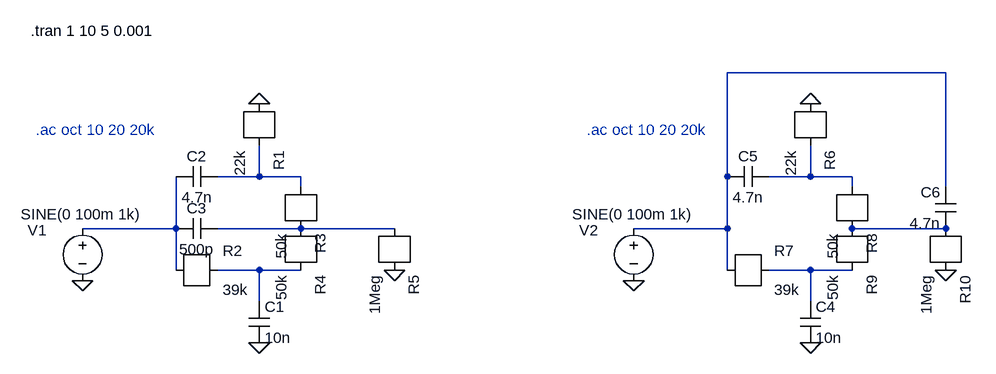
[diagram p0: schematic bigmuff_tone.asc]
bigmuff_tone.asc, the LTspice schematic file:
Version 4
SHEET 1 1460 680
WIRE 1440 208 1104 208
WIRE 384 368 384 320
WIRE 384 368 320 368
WIRE 448 368 384 368
WIRE 1104 368 1104 208
WIRE 1232 368 1232 320
WIRE 1232 368 1168 368
WIRE 1296 368 1232 368
WIRE 448 384 448 368
WIRE 1296 384 1296 368
WIRE 1440 384 1440 208
WIRE 256 448 256 368
WIRE 256 448 112 448
WIRE 448 448 320 448
WIRE 592 448 448 448
WIRE 1104 448 1104 368
WIRE 1104 448 960 448
WIRE 1440 448 1296 448
WIRE 256 512 256 448
WIRE 384 512 320 512
WIRE 448 512 384 512
WIRE 1104 512 1104 448
WIRE 1232 512 1168 512
WIRE 1296 512 1232 512
WIRE 384 560 384 512
WIRE 1232 560 1232 512
FLAG 384 624 0
FLAG 384 256 0
FLAG 592 512 0
FLAG 112 528 0
FLAG 1232 624 0
FLAG 1232 256 0
FLAG 1440 512 0
FLAG 960 528 0
SYMBOL r 384 256 R90
SYMATTR InstName R1
SYMATTR Value 22k
SYMBOL cap 368 560 R0
SYMATTR InstName C1
SYMATTR Value 10n
SYMBOL r 256 512 R0
SYMATTR InstName R2
SYMATTR Value 39k
SYMBOL cap 320 352 R90
WINDOW 0 0 32 VBottom 2
WINDOW 3 32 32 VTop 2
SYMATTR InstName C2
SYMATTR Value 4.7n
SYMBOL r 448 384 R90
SYMATTR InstName R3
SYMATTR Value 50k
SYMBOL voltage 112 432 R0
WINDOW 0 -84 19 Left 2
WINDOW 3 -95 -6 Left 2
SYMATTR InstName V1
SYMATTR Value SINE(0 100m 1k)
SYMATTR Value2 AC 100m
SYMBOL r 448 448 R90
SYMATTR InstName R4
SYMATTR Value 50k
SYMBOL r 592 448 R90
SYMATTR InstName R5
SYMATTR Value 1Meg
SYMBOL cap 320 432 R90
WINDOW 0 0 32 VBottom 2
WINDOW 3 32 32 VTop 2
SYMATTR InstName C3
SYMATTR Value 500p
SYMBOL r 1232 256 R90
SYMATTR InstName R6
SYMATTR Value 22k
SYMBOL cap 1216 560 R0
SYMATTR InstName C4
SYMATTR Value 10n
SYMBOL r 1104 512 R0
SYMATTR InstName R7
SYMATTR Value 39k
SYMBOL cap 1168 352 R90
WINDOW 0 0 32 VBottom 2
WINDOW 3 32 32 VTop 2
SYMATTR InstName C5
SYMATTR Value 4.7n
SYMBOL r 1296 384 R90
SYMATTR InstName R8
SYMATTR Value 50k
SYMBOL voltage 960 432 R0
WINDOW 0 -84 19 Left 2
WINDOW 3 -95 -6 Left 2
SYMATTR InstName V2
SYMATTR Value SINE(0 100m 1k)
SYMATTR Value2 AC 100m
SYMBOL r 1296 448 R90
SYMATTR InstName R9
SYMATTR Value 50k
SYMBOL r 1440 448 R90
SYMATTR InstName R10
SYMATTR Value 1Meg
SYMBOL cap 1456 448 R180
WINDOW 0 24 56 Left 2
WINDOW 3 24 8 Left 2
SYMATTR InstName C6
SYMATTR Value 4.7n
TEXT 40 296 Left 2 ;.ac oct 10 20 20k
TEXT 888 296 Left 2 ;.ac oct 10 20 20k
TEXT 32 144 Left 2 !.tran 1 10 5 0.001

The netlist it stands for:
* bigmuff_tone.asc
R1 N002 0 22k
C1 N007 0 10n
R2 N007 N004 39k
C2 N002 N004 4.7n
R3 N005 N002 50k
V1 N004 0 SINE(0 100m 1k) AC 100m
R4 N007 N005 50k
R5 0 N005 1Meg
C3 N005 N004 500p
R6 N003 0 22k
C4 N008 0 10n
R7 N008 N001 39k
C5 N003 N001 4.7n
R8 N006 N003 50k
V2 N001 0 SINE(0 100m 1k) AC 100m
R9 N008 N006 50k
R10 0 N006 1Meg
C6 N006 N001 4.7n
* .ac oct 10 20 20k
* .ac oct 10 20 20k
.tran 1 10 5 0.001
.backanno
.end